# EAGLE design IHM (EAGLE 9.6.2)

## Sheet 1 of 2: Carte IHM
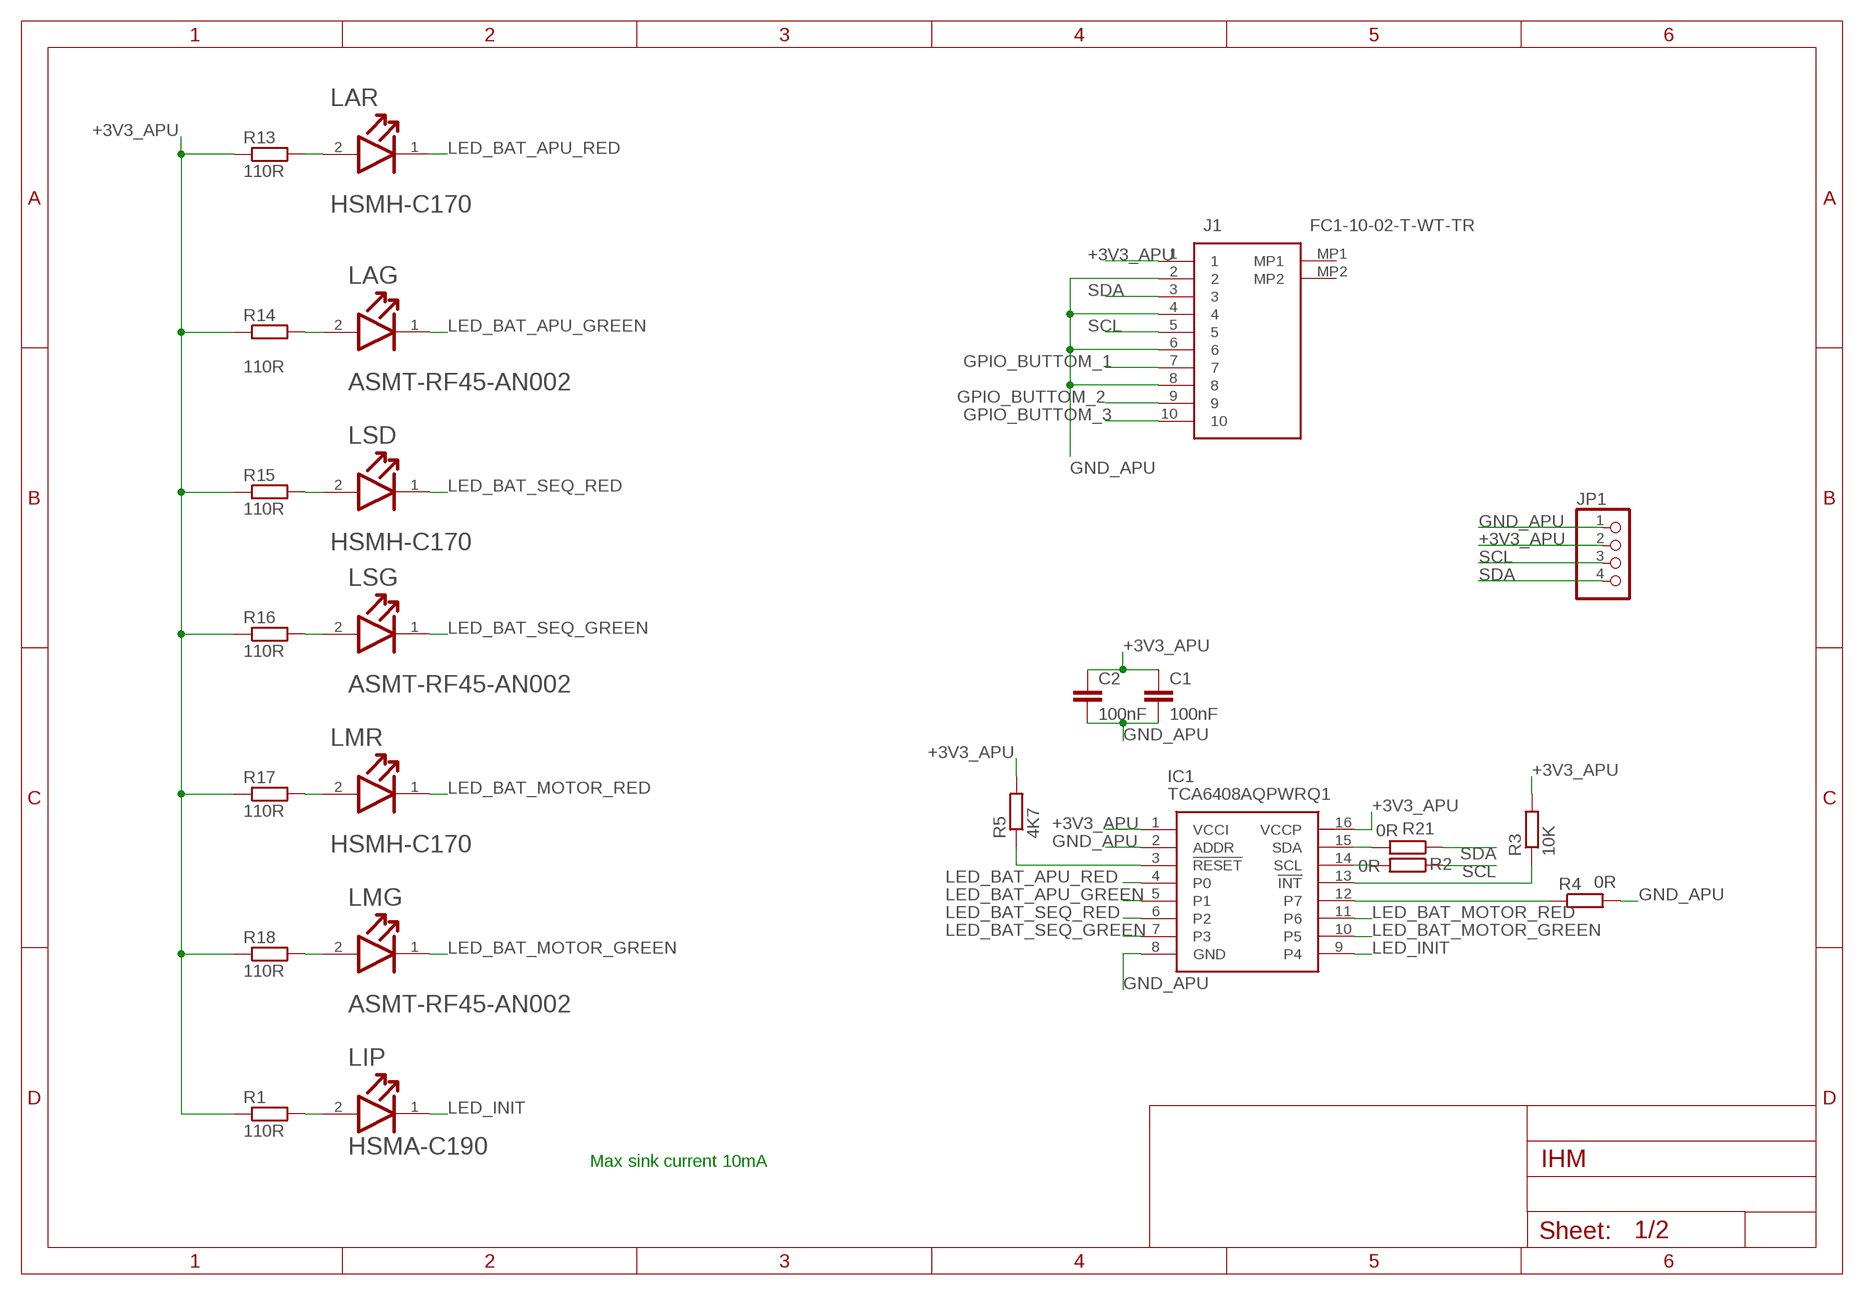
[diagram p0: schematic, sheet 1]

### Parts
C1  100nF  C-EUC0805  [C0805]
C2  100nF  C-EUC0805  [C0805]
IC1  TCA6408AQPWRQ1  [SOP65P640X120-16N]
J1  FC1-10-02-T-WT-TR  [FC11002TWTTR]
JP1  PINHD-1X4  [1X04]
LAG  BROADCOM_ASMT-RF45-AN002BROADCOM_ASMT-RF45-AN002_0_0  [BROADCOM_ASMT-RF45-AN002_0]
LAR  BROADCOM_HSMH-C170BROADCOM_HSMH-C170_0_0  [BROADCOM_HSMH-C170_0]
LIP  BROADCOM_HSMA-C190BROADCOM_HSMA-C190_0_0  [BROADCOM_HSMA-C190_0]
LMG  BROADCOM_ASMT-RF45-AN002BROADCOM_ASMT-RF45-AN002_0_0  [BROADCOM_ASMT-RF45-AN002_0]
LMR  BROADCOM_HSMH-C170BROADCOM_HSMH-C170_0_0  [BROADCOM_HSMH-C170_0]
LSD  BROADCOM_HSMH-C170BROADCOM_HSMH-C170_0_0  [BROADCOM_HSMH-C170_0]
LSG  BROADCOM_ASMT-RF45-AN002BROADCOM_ASMT-RF45-AN002_0_0  [BROADCOM_ASMT-RF45-AN002_0]
R1  110R  R-EU_R0603  [R0603]
R2  0R  R-EU_R0603  [R0603]
R3  10K  R-EU_R0603  [R0603]
R4  0R  R-EU_R0603  [R0603]
R5  4K7  R-EU_R0603  [R0603]
R13  110R  R-EU_R0603  [R0603]
R14  110R  R-EU_R0603  [R0603]
R15  110R  R-EU_R0603  [R0603]
R16  110R  R-EU_R0603  [R0603]
R17  110R  R-EU_R0603  [R0603]
R18  110R  R-EU_R0603  [R0603]
R21  0R  R-EU_R0603  [R0603]

### Nets
+3V3_APU [Power]: C1.1 C2.1 IC1.1(VCCI) IC1.16(VCCP) J1.1 JP1.2 R1.1 R3.2 R5.2 R13.1 R14.1 R15.1 R16.1 R17.1 R18.1 ; also sheet 2
GND_APU: C1.2 C2.2 IC1.2(ADDR) IC1.8(GND) J1.2 J1.4 J1.6 J1.8 JP1.1 R4.2 ; also sheet 2
GPIO_BUTTOM_1: J1.7 ; also sheet 2
GPIO_BUTTOM_2: J1.9 ; also sheet 2
GPIO_BUTTOM_3: J1.10 ; also sheet 2
LED_BAT_APU_GREEN: IC1.5(P1) LAG.1(CATHODE)
LED_BAT_APU_RED: IC1.4(P0) LAR.1(CATHODE)
LED_BAT_MOTOR_GREEN: IC1.10(P5) LMG.1(CATHODE)
LED_BAT_MOTOR_RED: IC1.11(P6) LMR.1(CATHODE)
LED_BAT_SEQ_GREEN: IC1.7(P3) LSG.1(CATHODE)
LED_BAT_SEQ_RED: IC1.6(P2) LSD.1(CATHODE)
LED_INIT: IC1.9(P4) LIP.1(CATHODE)
N$1: LIP.2(ANODE) R1.2
N$2 [50Ohms]: IC1.14(SCL) R2.2
N$3 [50Ohms]: IC1.13(!INT) R3.1
N$4: IC1.12(P7) R4.1
N$5: IC1.3(!RESET) R5.1
N$8: LAR.2(ANODE) R13.2
N$40: LAG.2(ANODE) R14.2
N$41: LSD.2(ANODE) R15.2
N$44: LSG.2(ANODE) R16.2
N$55: IC1.15(SDA) R21.2
N$58: LMR.2(ANODE) R17.2
N$59: LMG.2(ANODE) R18.2
SCL [50Ohms]: J1.5 JP1.3 R2.1
SDA [50Ohms]: J1.3 JP1.4 R21.1
Unconnected: J1.MP1 J1.MP2

### Notes on the sheet
- Max sink current 10mA

## Sheet 2 of 2: Bouton
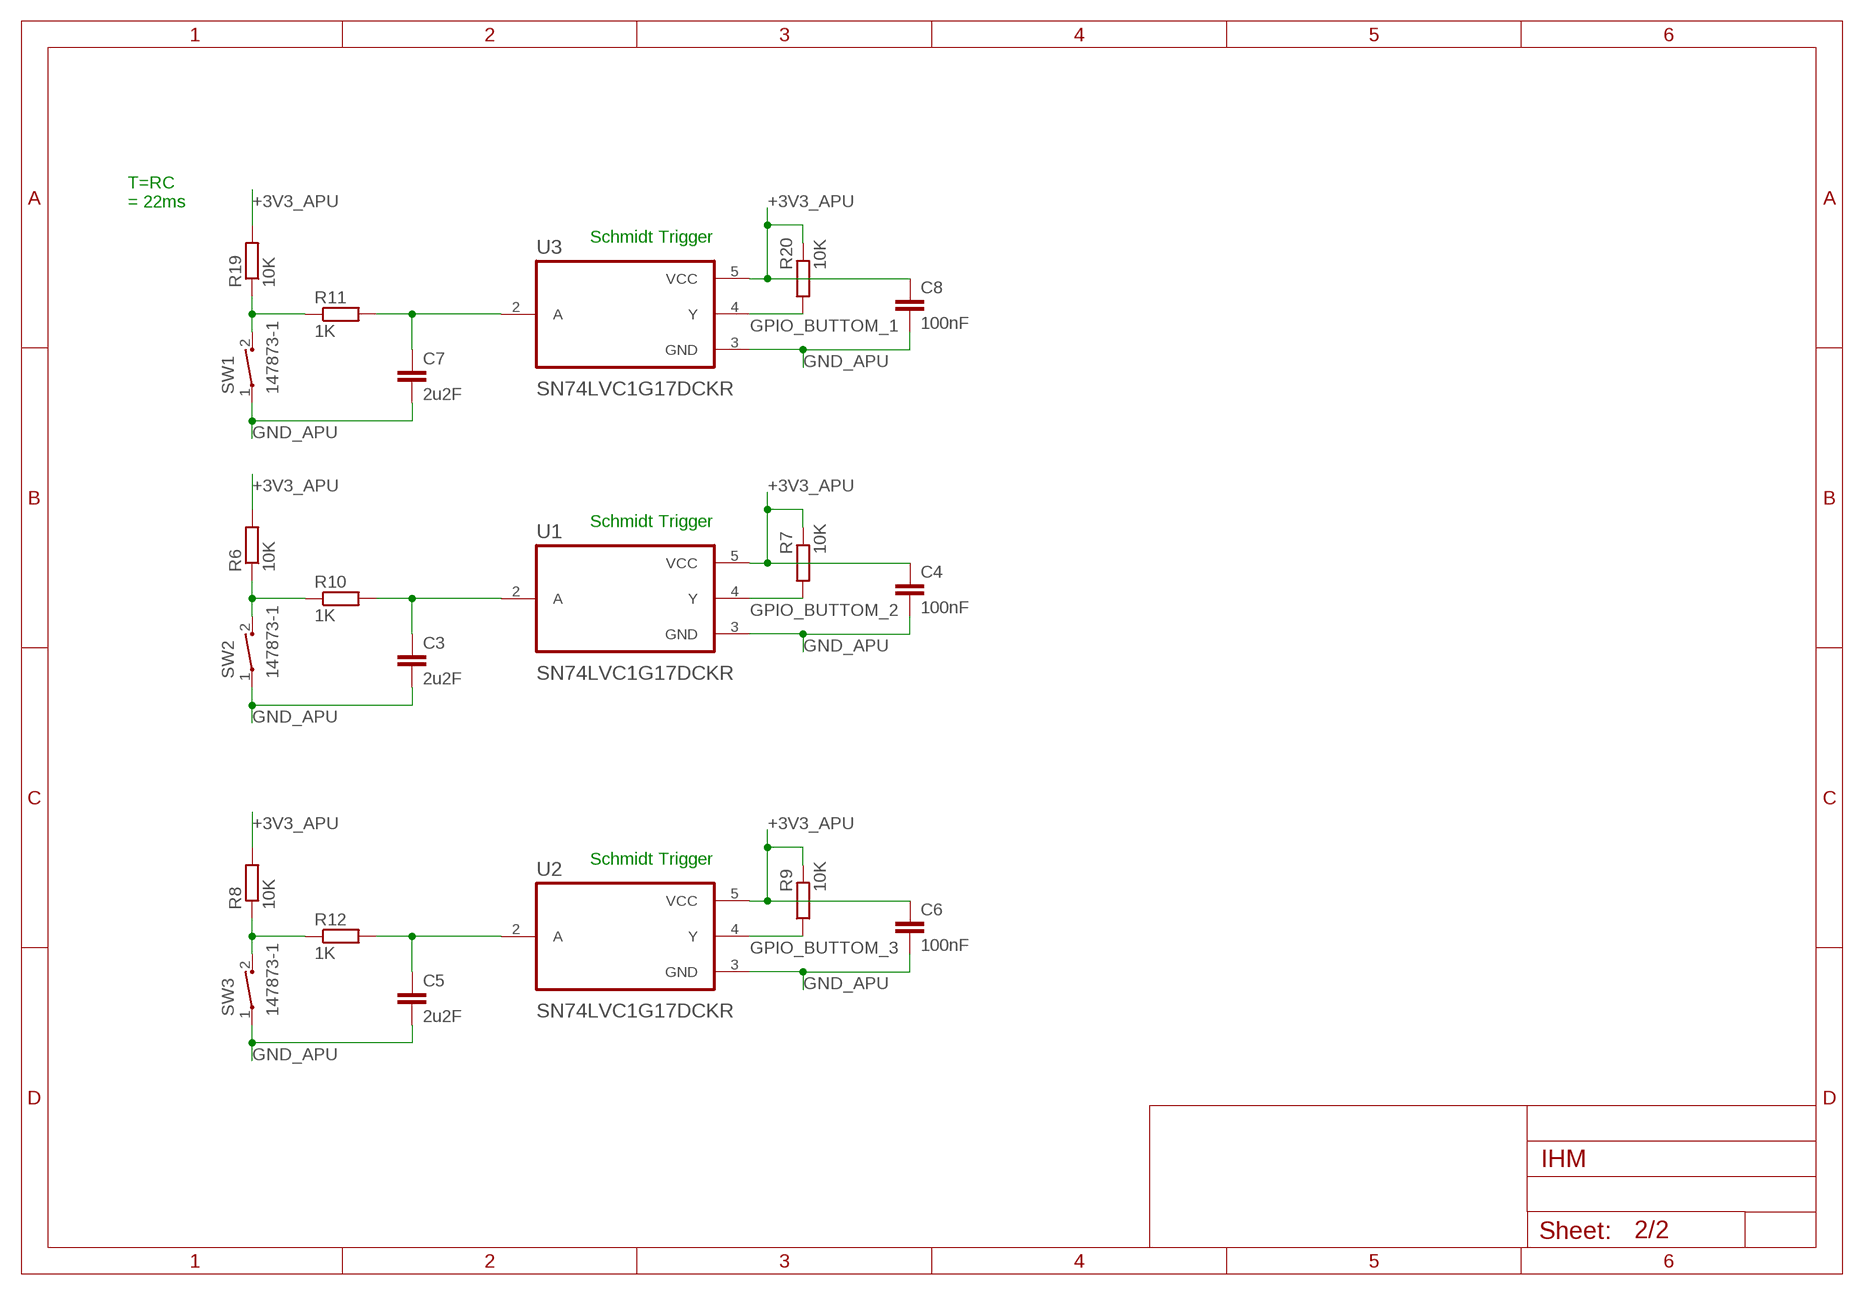
[diagram p1: schematic, sheet 2]

### Parts
C3  2u2F  C-EUC0805K  [C0805K]
C4  100nF  C-EUC0805K  [C0805K]
C5  2u2F  C-EUC0805K  [C0805K]
C6  100nF  C-EUC0805K  [C0805K]
C7  2u2F  C-EUC0805K  [C0805K]
C8  100nF  C-EUC0805K  [C0805K]
R6  10K  R-EU_R0603  [R0603]
R7  10K  R-EU_R0603  [R0603]
R8  10K  R-EU_R0603  [R0603]
R9  10K  R-EU_R0603  [R0603]
R10  1K  R-EU_R0603  [R0603]
R11  1K  R-EU_R0603  [R0603]
R12  1K  R-EU_R0603  [R0603]
R19  10K  R-EU_R0603  [R0603]
R20  10K  R-EU_R0603  [R0603]
SW1  147873-1  [SW_147873-1]
SW2  147873-1  [SW_147873-1]
SW3  147873-1  [SW_147873-1]
U1  SN74LVC1G17DCKR  [SOT65P210X110-5N]
U2  SN74LVC1G17DCKR  [SOT65P210X110-5N]
U3  SN74LVC1G17DCKR  [SOT65P210X110-5N]

### Nets
+3V3_APU [Power]: C4.1 C6.1 C8.1 R6.2 R7.2 R8.2 R9.2 R19.2 R20.2 U1.5(VCC) U2.5(VCC) U3.5(VCC) ; also sheet 1
GND_APU: C3.2 C4.2 C5.2 C6.2 C7.2 C8.2 SW1.1 SW2.1 SW3.1 U1.3(GND) U2.3(GND) U3.3(GND) ; also sheet 1
GPIO_BUTTOM_1: R20.1 U3.4(Y) ; also sheet 1
GPIO_BUTTOM_2: R7.1 U1.4(Y) ; also sheet 1
GPIO_BUTTOM_3: R9.1 U2.4(Y) ; also sheet 1
N$6: C3.1 R10.2 U1.2(A)
N$7: R6.1 R10.1 SW2.2
N$9: C5.1 R12.2 U2.2(A)
N$10: R8.1 R12.1 SW3.2
N$60: C7.1 R11.2 U3.2(A)
N$61: R11.1 R19.1 SW1.2

### Notes on the sheet
- T=RC
  = 22ms
- Schmidt Trigger
- Schmidt Trigger
- Schmidt Trigger

## Library data of the parts
C1-C8 = rcl:C-EU: CAPACITOR, European symbol; SPICEPREFIX: C
IC1 = TCA6408AQPWRQ1:TCA6408AQPWRQ1: Automotive Low-Voltage 8-Bit I2C and SMBus I/O Expander With Interrupt Output Source: Datasheet <http://www.ti.com/lit/gpn/tca6408a-q1>; ARROW_PART_NUMBER: TCA6408AQPWRQ1; ARROW_PRICE-STOCK: https://www.arrow.com/en/products/tca6408aqpwrq1/texas-instruments; DESCRIPTION: Automotive Low-Voltage 8-Bit I2C and SMBus I/O Expander With Interrupt Output; HEIGHT: 1.2mm; MANUFACTURER_NAME: Texas Instruments; MANUFACTURER_PART_NUMBER: TCA6408AQPWRQ1; MOUSER_PART_NUMBER: 595-TCA6408AQPWRQ1; MOUSER_PRICE-STOCK: https://www.mouser.co.uk/ProductDetail/Texas-Instruments/TCA6408AQPWRQ1/?qs=dn2ehRJXTX%252BDd5mX8WZrSw%3D%3D
J1 = FC1-10-02-T-WT-TR:FC1-10-02-T-WT-TR: FFC & FPC Connectors 1.00 mm Flat Flexible Cable (FFC) Socket Strip Source: Datasheet <http://suddendocs.samtec.com/prints/fc1-xx-xx-xx-xx-mkt.pdf>; DESCRIPTION: FFC & FPC Connectors 1.00 mm Flat Flexible Cable (FFC) Socket Strip; HEIGHT: 5.19mm; MANUFACTURER_NAME: SAMTEC; MANUFACTURER_PART_NUMBER: FC1-10-02-T-WT-TR; MOUSER_PART_NUMBER: 200-FC11002TWTTR; MOUSER_PRICE-STOCK: https://www.mouser.com/Search/Refine.aspx?Keyword=200-FC11002TWTTR
JP1 = pinhead:PINHD-1X4: PIN HEADER
LAG LMG LSG = Broadcom - ASMT-RF45-AN002:BROADCOM_ASMT-RF45-AN002: LED YLW/GREEN DIFFUSED 0603 SMD; AUTOMOTIVE: No; CENTROID_NOT_SPECIFIED: No; COLOUR: Yellow Green; DATASHEET: https://docs.broadcom.com/docs/AV02-0378EN; DEVICE_CLASS_L1: Optoelectronics; DEVICE_CLASS_L2: LEDs; DEVICE_CLASS_L3: unset; DIGIKEY_DESCRIPTION: DIODE LED YLW/GREEN DIFFUSED 0603 SMD; DIGIKEY_PART_NUMBER: 516-2522-1-ND; FOOTPRINT_VARIANT_NAME_0: Recommended_Land_Pattern; FORWARD_CURRENT: 20mA; FORWARD_VOLTAGE: 2V; HEIGHT: 0.55mm; LEAD_FREE: Yes; LED_ORIENTATION: Top View; LUMINOUS_INTENSITY: 60mcd; MAX_JUNCTION_TEMP: +110°C; MF: Broadcom; MFG_PACKAGE_IDENT: ASMT-RF45-AN002; MFG_PACKAGE_IDENT_DATE: 0; MFG_PACKAGE_IDENT_REV: 0; MOUSER_DESCRIPTION: LED; SMD; 0603; yellow green; 28-60mcd; 1.6x0.8x0.45mm; 145°; 20mA; MOUSER_PART_NUMBER: 630-ASMT-RF45-AN002; MPN: ASMT-RF45-AN002; PACKAGE: SMD2; PEAK_EMMISION_WAVELENGTH: 574nm; POWER_DISSIPATION: 48mW; PREFIX: D; REVERSE_VOLTAGE: 5V; ROHS: Yes; TEMPERATURE_RANGE_HIGH: +100°C; TEMPERATURE_RANGE_LOW: -40°C; VERIFICATION_VERSION: 0.0.0.3; VIEWING_ANGLE: 145°; WAVELENGTH: 573nm
LAR LMR LSD = Broadcom - HSMH-C170:BROADCOM_HSMH-C170: LED RED DIFFUSED 0805 SMD; CENTROID_NOT_SPECIFIED: No; COLOUR: Red; DATASHEET: https://media.digikey.com/pdf/Data%20Sheets/Avago%20PDFs/HSMz-Czzz.pdf; DEVICE_CLASS_L1: Optoelectronics; DEVICE_CLASS_L2: LEDs; DEVICE_CLASS_L3: unset; DIGIKEY_DESCRIPTION: DIODE LED RED DIFFUSED 0805 SMD; DIGIKEY_PART_NUMBER: 516-1427-1-ND; FORWARD_CURRENT: 25mA; FORWARD_VOLTAGE: 1.8V; HEIGHT: 0.9mm; LEAD_FREE: yes; LED_ORIENTATION: Top View; LUMINOUS_INTENSITY: 17mcd; MAX_JUNCTION_TEMP: +95°C; MF: Broadcom; MFG_PACKAGE_IDENT: HSMH-C170; MFG_PACKAGE_IDENT_DATE: 0; MFG_PACKAGE_IDENT_REV: 0; MOUSER_PART_NUMBER: 630-HSMH-C170; MPN: HSMH-C170; PACKAGE: 0805 (2012 metric); POWER_DISSIPATION: 65mW; PREFIX: D; REVERSE_VOLTAGE: 5V; ROHS: yes; STANDOFF_HEIGHT: 0mm; TEMPERATURE_RANGE_HIGH: +85°C; TEMPERATURE_RANGE_LOW: -40°C; VERIFICATION_VERSION: 0.0.0.1; VIEWING_ANGLE: 170°; WAVELENGTH: 639nm
LIP = Broadcom - HSMA-C190:BROADCOM_HSMA-C190: Amber 592nm LED Indication - Discrete 1.9V 0603 (1608 Metric); AUTOMOTIVE: No; CENTROID_NOT_SPECIFIED: No; COLOUR: Amber; DATASHEET: https://docs.broadcom.com/doc/AV02-0112EN; DEVICE_CLASS_L1: Optoelectronics; DEVICE_CLASS_L2: LEDs; DEVICE_CLASS_L3: unset; DIGIKEY_DESCRIPTION: LED AMBER DIFFUSED CHIP SMD; DIGIKEY_PART_NUMBER: 516-1423-1-ND; FOOTPRINT_VARIANT_NAME_0: Recommended_Land_Pattern; FORWARD_CURRENT: 20mA; FORWARD_VOLTAGE: 1.9V; HEIGHT: 0.9mm; LEAD_FREE: Yes; LED_ORIENTATION: Top View; LUMINOUS_INTENSITY: 90mcd; MAX_JUNCTION_TEMP: +95°C; MF: Broadcom; MFG_PACKAGE_IDENT: 0; MFG_PACKAGE_IDENT_DATE: 0; MFG_PACKAGE_IDENT_REV: 0; MOUSER_DESCRIPTION: LED Uni-Color Amber 595nm 2-Pin Chip LED T/R; MOUSER_PART_NUMBER: 630-HSMA-C190; MPN: HSMA-C190; PACKAGE: 0603; PEAK_EMMISION_WAVELENGTH: 595nm; POWER_DISSIPATION: 60mW; PREFIX: D; REVERSE_VOLTAGE: 5V; ROHS: Yes; TEMPERATURE_RANGE_HIGH: +85°C; TEMPERATURE_RANGE_LOW: -40°C; VERIFICATION_VERSION: 0.0.0.3; VIEWING_ANGLE: 170°; VOLTAGE: 1.9V; WAVELENGTH: 592nm
R1-R21 = rcl:R-EU_: RESISTOR, European symbol; SPICEPREFIX: R
SW1-SW3 = 147873-1:147873-1: Switch Tactile OFF (ON) SPST Rectangular Button J-Bend 0.05A 24VDC 1.77N SMD T/R Check prices <https://pricing.snapeda.com/parts/147873-1/TE%20Connectivity/view-part?ref=eda>; AVAILABILITY: Good; COMMENT: 147873-1; DESCRIPTION: Switch Tactile OFF (ON) SPST Rectangular Button J-Bend 0.05A 24VDC 1.77N SMD T/R; MF: TE Connectivity; MP: 147873-1; PACKAGE: None; PRICE: None; PURCHASE-URL: https://pricing.snapeda.com/search/part/147873-1/?ref=eda
U1-U3 = SN74LVC1G17DCKR:SN74LVC1G17DCKR: Check prices <https://pricing.snapeda.com/parts/SN74LVC1G17DCKR/Texas%20Instruments/view-part?ref=eda>; AVAILABILITY: Good; DESCRIPTION: Single Schmitt-Trigger Buffer 5-SC70 -40 to 125; MF: Texas Instruments; MP: SN74LVC1G17DCKR; PACKAGE: SOT-SC70-5 Texas Instruments; PRICE: None; PURCHASE-URL: https://pricing.snapeda.com/search/part/SN74LVC1G17DCKR/?ref=eda

## Net classes
0 default: width 0.2 mm, clearance 0.127 mm
1 Power: width 0.4 mm, clearance 0.2 mm
2 50Ohms: width 0.147 mm, clearance 0.127 mm

## Board
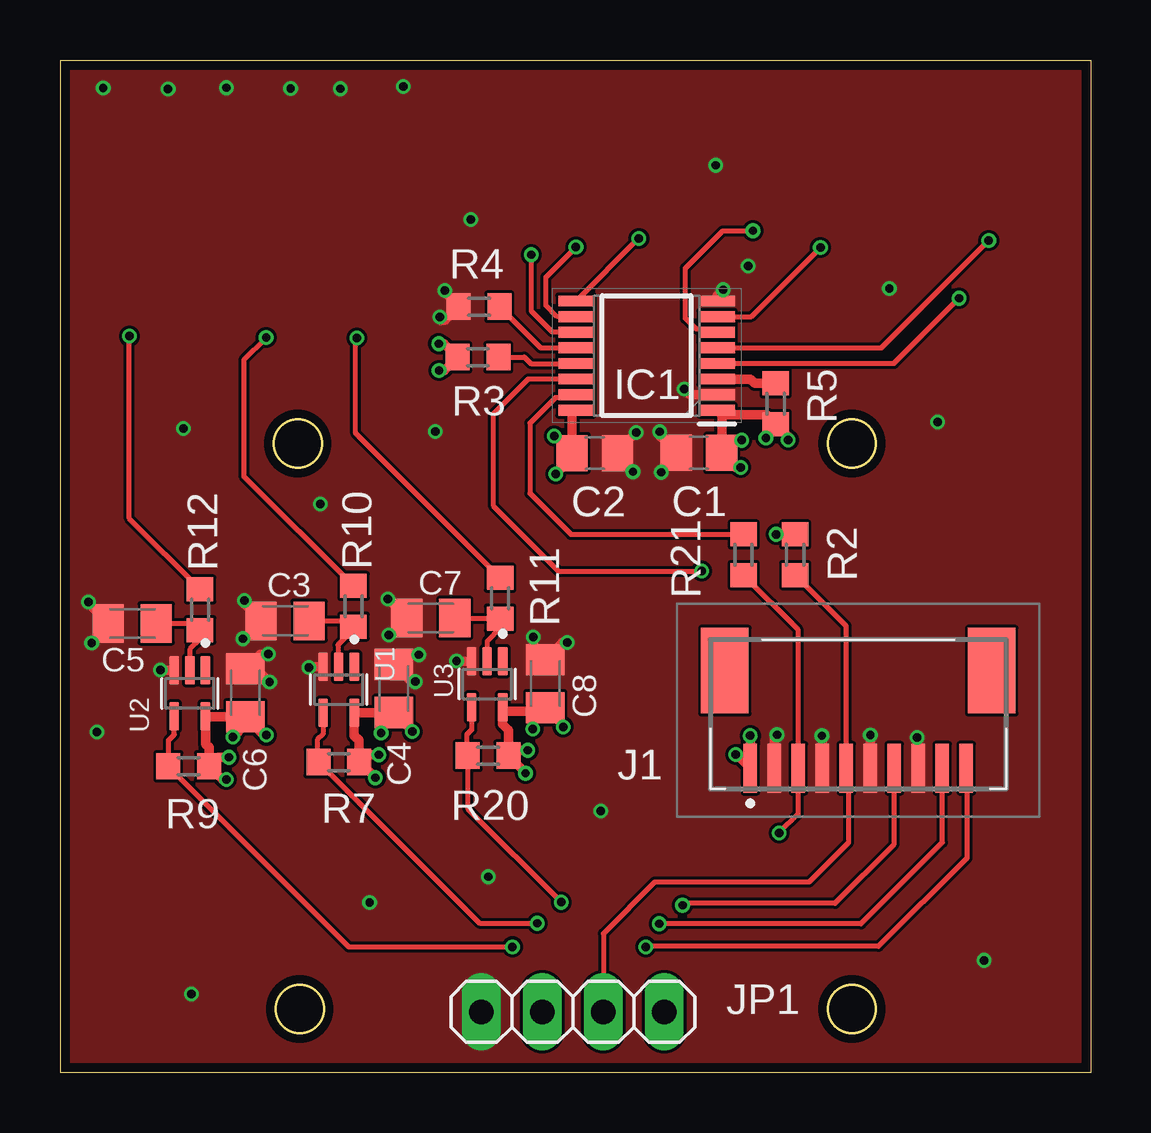
[diagram p2: board, top side]
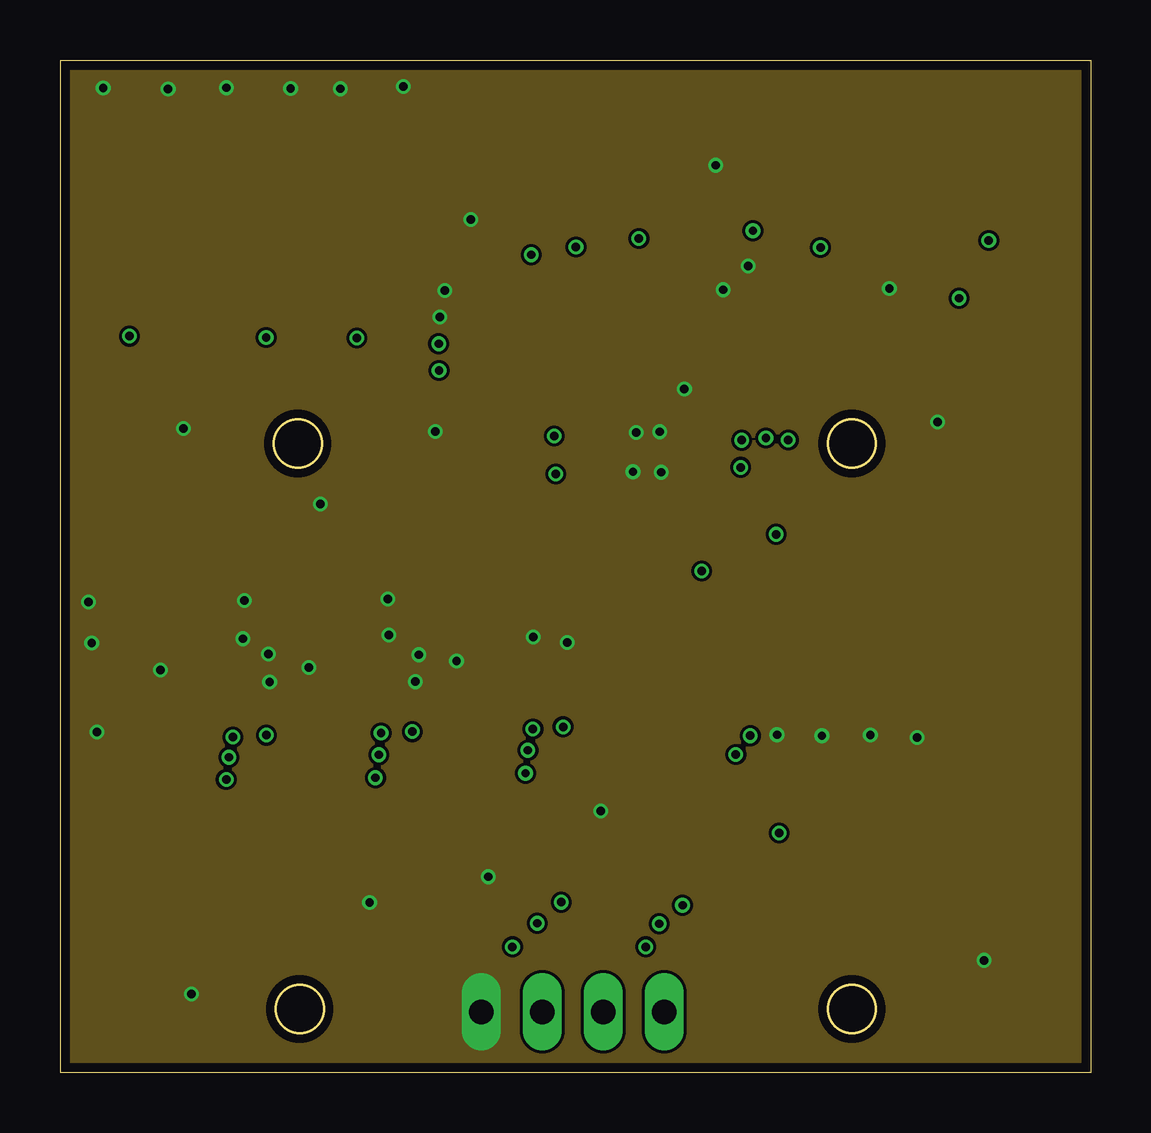
[diagram p3: board, inner layer Route2]
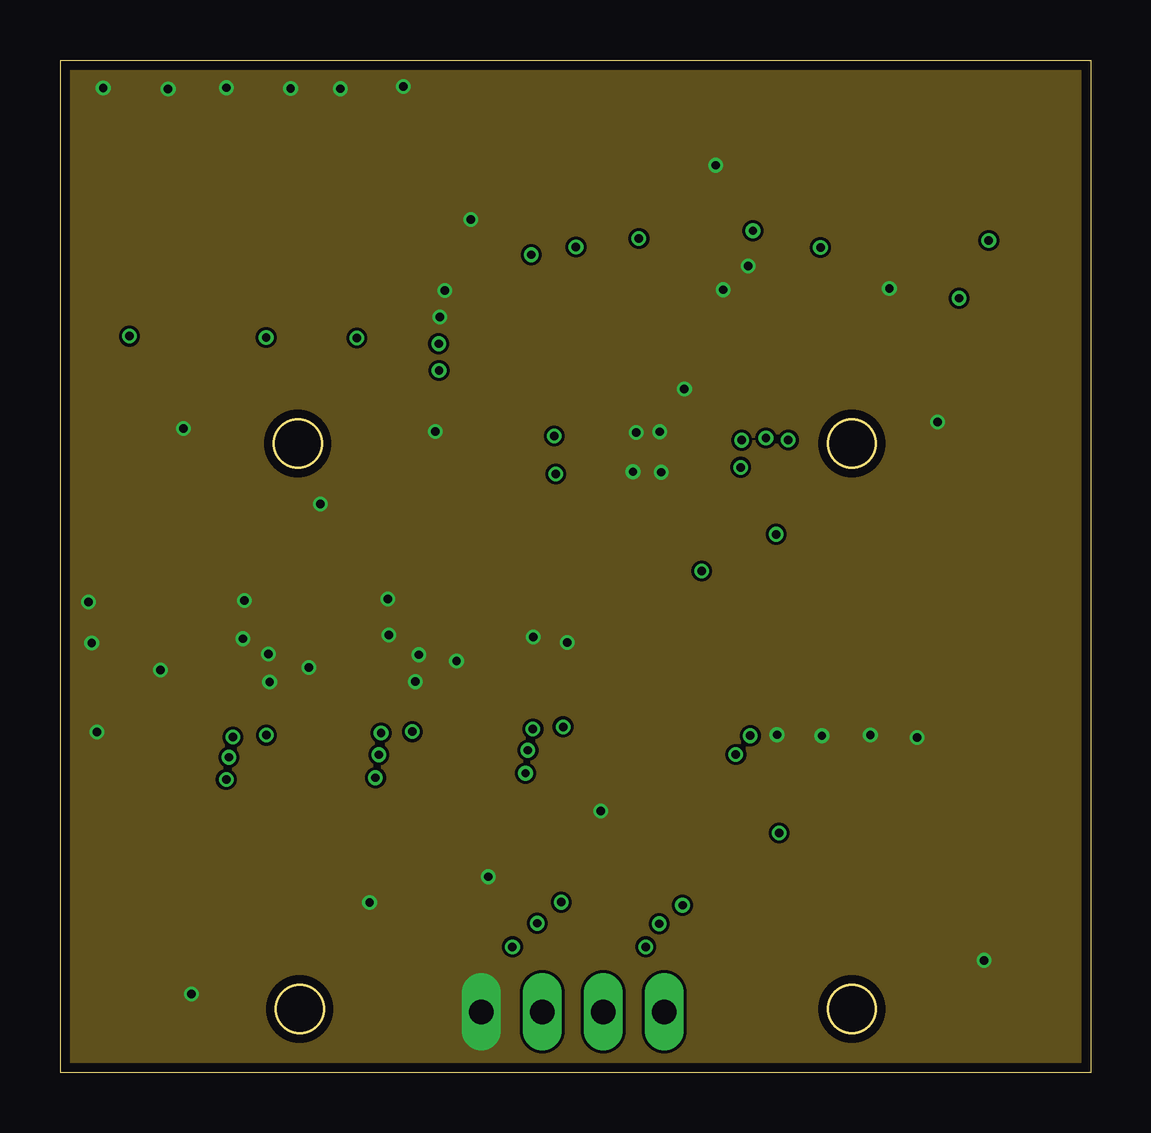
[diagram p4: board, inner layer Route15]
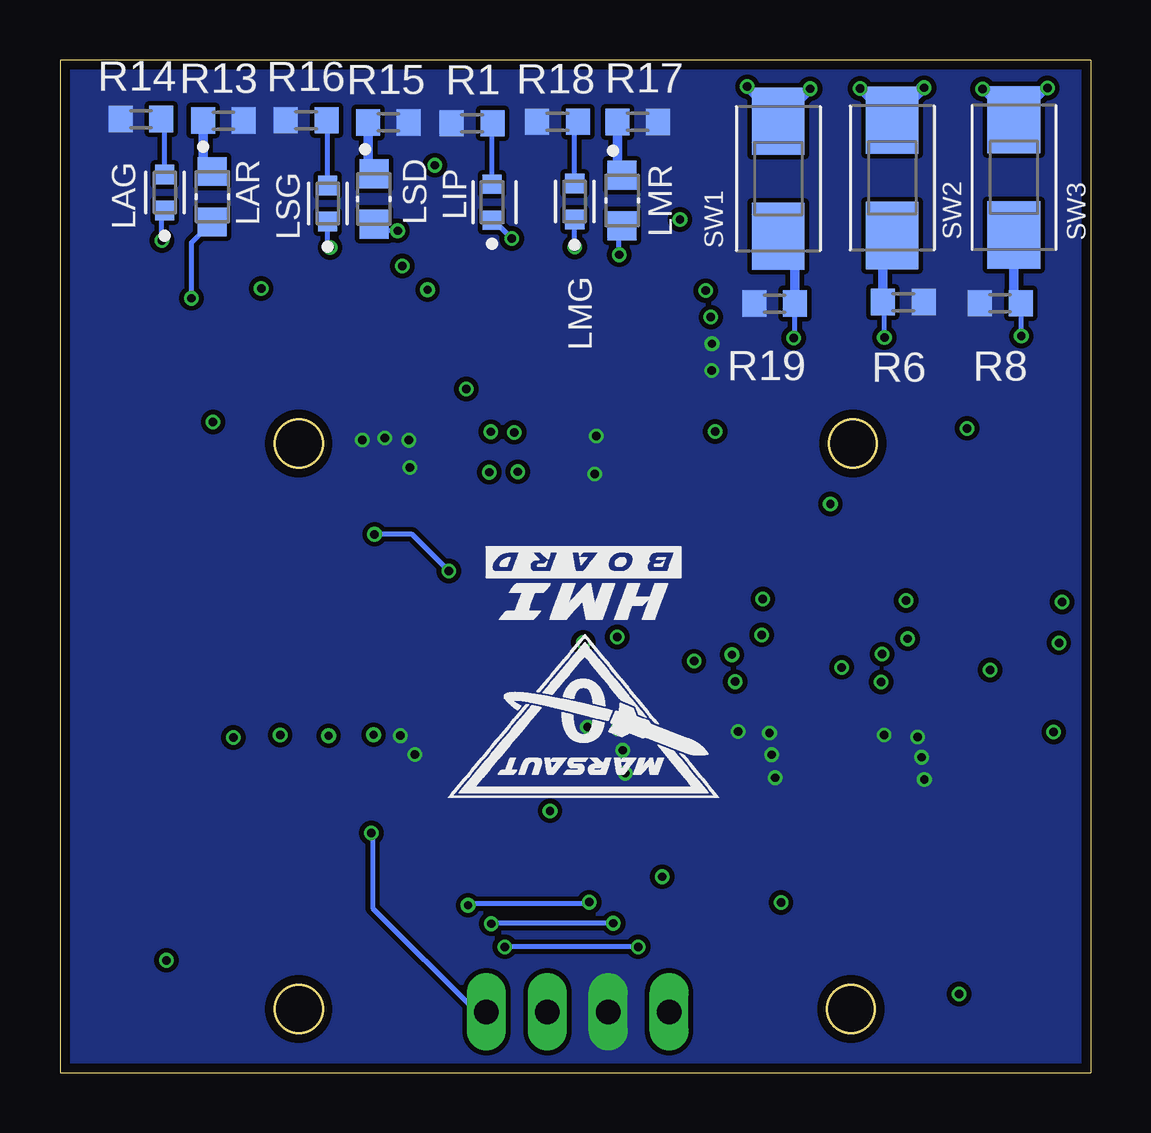
[diagram p5: board, bottom side, seen from below]

Size 42.96 x 42.2 mm. Coordinates in mm from the lower left corner, seen from the top.
Outline: 0,42.2 0,0 42.96,0 42.96,42.2 0,42.2
Outline: circle at 9.99,2.66 radius 1
Outline: circle at 9.91,26.22 radius 1
Outline: circle at 33.01,2.66 radius 1
Outline: circle at 33.01,26.22 radius 1
Copper layers (1+2*15+16): Top 0.035mm / dielectric 0.1mm / Route2 0.0175mm / dielectric 1.265mm / Route15 0.0175mm / dielectric 0.1mm / Bottom 0.035mm
Design rules "Marsaut0": minimum track width 3.5mil, minimum drill 0.2mm, track to track 4mil, track to pad 0.2mm, pad to pad 5mil, via to via 0.5mm, smd to smd 5mil, copper to edge 0.4mm, drill to drill 0.5mm, minimum pad ring 0.3mm, minimum via ring 0.13mm, stop-mask expansion 4mil, vias tented up to drill 0mil, thermal gap 10mil

### Footprints (pad centres in the part's own frame; a part is rotated, then mirrored left to right if it is on the bottom)
C0805 = smd 1.3 x 1.5: 1 -0.95,0; 2 0.95,0
C0805K = smd 1.3 x 1.6: 1 -1,0; 2 1,0
SOP65P640X120-16N = smd 1.475 x 0.45: 1 -2.938,2.275; 2 -2.938,1.625; 3 -2.938,0.975; 4 -2.938,0.325; 5 -2.938,-0.325; 6 -2.938,-0.975; 7 -2.938,-1.625; 8 -2.938,-2.275; 9 2.938,-2.275; 10 2.938,-1.625; 11 2.938,-0.975; 12 2.938,-0.325; 13 2.938,0.325; 14 2.938,0.975; 15 2.938,1.625; 16 2.938,2.275
FC11002TWTTR = smd 0.56 x 2.03: 1 -4.5,0.865; 2 -3.5,0.865; 3 -2.5,0.865; 4 -1.5,0.865; 5 -0.5,0.865; 6 0.5,0.865; 7 1.5,0.865; 8 2.5,0.865; 9 3.5,0.865; 10 4.5,0.865 | smd 1.98 x 3.56: MP1 -5.56,4.93; MP2 5.56,4.93
1X04 = drill 1.016 long: 1 -3.81,0; 2 -1.27,0; 3 1.27,0; 4 3.81,0
BROADCOM_ASMT-RF45-AN002_0 = smd 0.8 x 0.8: 1 -0.75,0; 2 0.75,0
BROADCOM_HSMH-C170_0 = smd 1.2 x 1.2: 1 -1.05,0; 2 1.05,0
BROADCOM_HSMA-C190_0 = smd 0.8 x 0.8: 1 -0.75,0; 2 0.75,0
R0603 = smd 1 x 1.1: 1 -0.85,0; 2 0.85,0
SW_147873-1 = smd 2.8 x 2.2: 1 -2.4,0; 2 2.4,0
SOT65P210X110-5N = smd 1.19 x 0.4: 1 -0.96,0.65; 2 -0.96,0; 3 -0.96,-0.65; 4 0.96,-0.65; 5 0.96,0.65

### Placement (x,y rotation side)
C1  26.63,25.84 180 top
C2  22.29,25.82 0 top
C3  9.39,18.83 180 top
C4  13.92,16.01 90 top
C5  3.01,18.72 180 top
C6  7.73,15.84 90 top
C7  15.46,18.95 180 top
C8  20.23,16.21 90 top
IC1  24.45,29.88 180 top
J1  33.27,11.83 0 top
JP1  21.38,2.54 0 top
LAG  38.59,36.68 90 bottom
LAR  36.61,36.5 90 bottom
LIP  24.95,36.27 90 bottom
LMG  21.5,36.3 90 bottom
LMR  19.53,36.35 90 bottom
LSD  29.87,36.41 90 bottom
LSG  31.8,36.22 90 bottom
R1  25.78,39.56 0 bottom
R2  30.65,21.59 90 top
R3  17.42,29.82 180 top
R4  17.47,31.93 180 top
R5  29.83,27.87 270 top
R6  7.81,32.11 0 bottom
R7  11.62,12.94 0 top
R8  3.77,32.07 180 bottom
R9  5.36,12.77 0 top
R10  12.23,19.44 270 top
R11  18.35,19.78 270 top
R12  5.84,19.29 270 top
R13  36.15,39.68 180 bottom
R14  39.59,39.73 0 bottom
R15  29.28,39.6 180 bottom
R16  32.7,39.69 0 bottom
R17  18.87,39.62 180 bottom
R18  22.22,39.63 0 bottom
R19  13.17,32.05 180 bottom
R20  17.85,13.22 0 top
R21  28.5,21.58 90 top
SW1  13.02,37.25 270 bottom
SW2  8.27,37.28 270 bottom
SW3  3.2,37.31 270 bottom
U1  11.62,15.96 270 top
U2  5.41,15.81 270 top
U3  17.81,16.19 270 top

### Tracks (layer width: path | path; a pad name or v marks a point on that pad's centre or on a via)
+3V3_APU  (via drill 0.35)
  Top 0.4: C2.1 21.34,27.43 IC1.16 | C1.1 27.59,27.41 | 27.59,27.41 IC1.1 | R5.2 29.45,27.41 27.59,27.41 | C6.1 6.08,14.84 | 6.08,14.84 U2.5 | C4.1 U1.5 12.27,14.05 12.47,13.85 R7.2 | R20.2 18.7,14.28 18.46,14.52 18.46,15.07 | 18.46,15.07 U3.5 | C8.1 20.09,15.07 18.46,15.07 | R9.2 6.21,13.55 6.07,13.7 6.07,14.83 6.08,14.84 | C1.1 28.11,26.36 v28.41,26.36 | C1.1 28.22,25.2 28.38,25.2 v28.38,25.23 | R5.2 29.43,26.61 v29.43,26.45 | R5.2 30.36,26.5 v30.36,26.36 | C2.1 21.34,25.61 v20.68,24.95 v20.67,24.95 | C6.1 8.5,14.07 v8.61,14.07 | C6.1 7.73,14.51 v7.21,13.98 | C4.1 14.69,14.24 v14.69,14.21 | C4.1 13.39,14.48 v13.39,14.16 | C8.1 20.97,14.47 v20.97,14.42 | C8.1 19.71,14.7 v19.71,14.32 | R9.2 6.59,13.15 v7.04,13.15 | R9.2 6.77,12.22 v6.93,12.22 | R7.2 12.78,13.25 v13.29,13.25 | R7.2 12.5,12.94 v13.15,12.29 | R20.2 18.91,13.43 v19.51,13.43 v19.51,13.44 | R20.2 19.39,12.52 v19.39,12.48 v19.41,12.48 | v28.78,14.05 v28.77,14.04 J1.1 28.21,13.26 v28.17,13.26 | v15.79,30.38 16.01,30.38 R3.2 16.02,29.26 v15.8,29.26 | C2.1 20.63,26.53 v20.61,26.53
  pour Bottom (no thermals): -5.02,45.78 47.05,45.78 47.15,45.88 47.15,-1.53 -5.03,-1.49
GND_APU  (via drill 0.35)
  Top 0.4: IC1.8 27.39,32.38 v27.64,32.63 | IC1.2 26.27,28.26 v26.03,28.5 | v25.01,26.71 25.01,26.51 C1.2 25.68,25.65 v25.06,25.02 | v24.03,26.68 23.24,25.89 C2.2 23.24,25.68 v23.88,25.04 | v24.03,26.68 | v24.03,26.68 v24.03,26.69 | v1.19,19.61 1.19,19.55 C5.2 2.01,18.61 v1.32,17.91 | v7.69,19.68 7.69,19.53 C3.2 7.64,18.09 v7.63,18.09 | v8.7,17.44 8.34,17.44 C6.2 8.19,16.84 v8.74,16.29 | v14.81,16.3 14.8,16.31 14.61,16.31 C4.2 14.33,17.42 v14.95,17.42 | v13.71,18.25 13.76,18.25 C7.2 v13.67,19.74 v13.66,19.74 | U1.3 10.41,16.92 v10.38,16.89 | U2.3 v4.2,16.77 v4.19,16.78 | U3.3 v16.54,17.15 v16.53,17.15 | v16.53,17.15 | v21.15,17.93 20.94,17.93 C8.2 19.73,17.71 v19.73,18.16 | J1.2 29.77,14.08 29.77,14.09 v29.89,14.09 | J1.4 31.77,14.03 v31.76,14.04 | J1.6 v33.77,14.07 v33.78,14.07 | J1.8 35.73,12.73 v35.73,13.97 | v16.04,32.59 16.04,32.5 R4.2 16.05,31.36 15.83,31.36 v15.83,31.48
  Bottom 0.4: v1.8,41.03 1.87,41.03 SW3.1 4.48,40.99 v4.51,40.99 | v6.94,41.04 7.09,41.04 7.09,40.87 SW2.1 v9.6,41.01 v9.61,41.01 | v11.69,41 11.69,40.98 SW1.1 13.02,39.78 14.32,41.08 | 14.32,41.08 | 14.32,41.08 v14.31,41.09
  other vias: 22.54,10.91 38.52,4.69 12.91,7.1 17.86,8.17 5.48,3.28 1.54,14.2 5.15,26.85 10.85,23.7 15.65,26.72 17.12,35.56 27.34,37.82 34.57,32.68 28.69,33.62 36.58,27.12
  pour Route15 (no thermals): -4.99,45.8 47.04,45.8 47.14,45.9 47.14,-1.51 47.17,-1.54 -5,-1.5
  pour Route2 (no thermals): -5.02,45.77 47.05,45.77 47.14,45.87 47.14,-1.53 -5.03,-1.5
  pour Top (no thermals): -5.02,45.77 47.04,45.77 47.14,45.87 47.14,-1.54 -5.03,-1.5
GPIO_BUTTOM_1  (via drill 0.35)
  Top 0.2: U3.4 17.16,14.29 16.95,14.09 16.95,13.26 R20.1 17,11.01 v20.9,7.11 | v25.95,6.98 25.95,7.06 32.31,7.06 34.77,9.53 J1.7
  Bottom 0.2: v20.9,7.11 20.96,7.05 25.95,7.05 v25.95,6.98
GPIO_BUTTOM_2  (via drill 0.35)
  Top 0.2: U1.4 10.97,14.12 10.73,13.88 10.73,12.99 R7.1 17.48,6.23 v19.89,6.23 | v24.98,6.21 33.39,6.21 36.78,9.6 36.78,12.68 J1.9
  Bottom 0.2: 25.11,6.21 v24.98,6.21 24.98,6.23 v19.89,6.23
GPIO_BUTTOM_3  (via drill 0.35)
  Top 0.2: U2.4 4.76,14.09 4.51,13.84 R9.1 12.04,5.25 v18.86,5.25 | v24.42,5.25 24.44,5.27 34.12,5.27 37.82,8.96 37.82,12.65 J1.10
  Bottom 0.2: v18.86,5.25 v24.42,5.25
LED_BAT_APU_GREEN  (via drill 0.35)
  Top 0.2: IC1.5 34.24,30.21 v38.72,34.68
  Bottom 0.2: v38.72,34.68 38.72,35.81 LAG.1
LED_BAT_APU_RED  (via drill 0.35)
  Top 0.2: IC1.4 34.76,29.56 v37.48,32.27
  Bottom 0.2: v37.48,32.27 37.48,34.59 LAR.1
LED_BAT_MOTOR_GREEN  (via drill 0.35)
  Top 0.2: IC1.10 20.72,31.51 20.26,31.98 20.26,33.15 v21.51,34.41
  Bottom 0.2: v21.51,34.41 v21.5,34.41 LMG.1
LED_BAT_MOTOR_RED  (via drill 0.35)
  Top 0.2: IC1.11 20.53,30.86 19.65,31.74 v19.65,34.09
  Bottom 0.2: v19.65,34.09 19.65,35.18 LMR.1
LED_BAT_SEQ_GREEN  (via drill 0.35)
  Top 0.2: IC1.7 28.82,31.51 v31.7,34.39
  Bottom 0.2: v31.7,34.39 31.8,34.49 LSG.1
LED_BAT_SEQ_RED  (via drill 0.35)
  Top 0.2: IC1.6 27.26,30.98 26.53,30.98 26.07,31.44 26.07,33.53 27.63,35.09 v28.89,35.09
  Bottom 0.2: v28.89,35.09 29.6,35.09 LSD.1
LED_INIT  (via drill 0.35)
  Top 0.2: IC1.9 24.12,34.76 v24.13,34.76
  Bottom 0.2: v24.13,34.76 24.89,35.52 LIP.1
N$1
  Bottom 0.2: LIP.2 24.95,39.55 R1.2
N$2  (via drill 0.35)
  Top 0.2: IC1.14 19.52,28.91 18.06,27.45 18.06,23.63 20.78,20.91 v26.75,20.91 | v29.85,22.44 R2.2
  Bottom 0.2: v26.75,20.91 28.28,22.44 v29.85,22.44
N$3
  Top 0.2: R3.1 19.36,29.82 19.63,29.55 21.5,29.55 IC1.13
N$4
  Top 0.2: R4.1 20.04,30.21 IC1.12
N$5
  Top 0.4: R5.1 28.97,28.72 28.79,28.91 IC1.3
N$6
  Top 0.2: C3.1 11.99,18.83 R10.2 12.23,18.48 11.59,17.83 11.59,16.95 U1.2
N$7  (via drill 0.35)
  Top 0.2: R10.1 7.66,24.87 7.66,29.7 v8.6,30.64
  Bottom 0.2: v8.6,30.64 8.6,32.05 R6.1
  Bottom 0.4: R6.1 8.66,34.5 SW2.2
N$8
  Bottom 0.4: R13.2 37,37.94 LAR.2
N$9
  Top 0.2: U2.2 5.41,17.64 5.84,18.07 R12.2 5.56,18.73 C5.1
N$10  (via drill 0.35)
  Top 0.2: R12.1 2.89,23.09 v2.89,30.69
  Bottom 0.2: v2.89,30.69 2.89,32.04 R8.1
  Bottom 0.4: SW3.2 3.2,32.34 R8.1
N$40
  Bottom 0.2: LAG.2 38.59,39.59 R14.2
N$41
  Bottom 0.4: R15.2 30.13,37.71 LSD.2
N$44
  Bottom 0.2: LSG.2 31.8,39.64 R16.2
N$55
  Top 0.2: IC1.15 21.39,28.13 20.65,28.13 19.59,27.07 19.59,24.14 21.29,22.43 R21.2
N$58
  Bottom 0.4: R17.2 19.73,37.59 LMR.2
N$59
  Bottom 0.2: LMG.2 21.5,39.5 R18.2
N$60
  Top 0.2: U3.2 17.81,17.99 18.35,18.54 R11.2 18.33,18.95 C7.1
N$61  (via drill 0.35)
  Top 0.2: R11.1 12.33,26.65 12.33,30.57 v12.38,30.61
  Bottom 0.2: v12.38,30.61 12.32,30.67 R19.1
  Bottom 0.4: R19.1 12.32,34.15 SW1.2
SCL
  Top 0.2: R2.1 32.77,18.61 J1.5 32.88,12.59 32.88,9.6 31.23,7.95 24.79,7.95 22.65,5.8 JP1.3
SDA  (via drill 0.35)
  Top 0.2: R21.1 30.77,18.46 J1.3 30.77,10.79 v29.98,9.99
  Bottom 0.2: v29.98,9.99 29.93,9.94 29.93,6.86 25.6,2.54 JP1.4